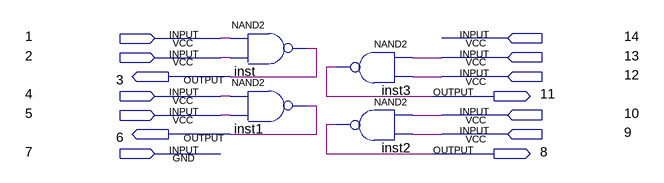
[diagram p0: schematic sheet]
// Quartus schematic 7400.bdf as structural Verilog: 4 symbols, 14 pins
module \7400  (
  input  \1 ,
  input  \14 ,
  input  \2 ,
  input  \13 ,
  input  \12 ,
  input  \4 ,
  input  \5 ,
  input  \10 ,
  input  \9 ,
  input  \7 ,
  output \3 ,
  output \11 ,
  output \6 ,
  output \8 
);

  nand inst (\3 , \1 , \2 );
  nand inst1 (\6 , \4 , \5 );
  nand inst3 (\11 , \13 , \12 );
  nand inst2 (\8 , \10 , \9 );
endmodule
